# EAGLE schematic MiniLab (EAGLE 7.5.0)
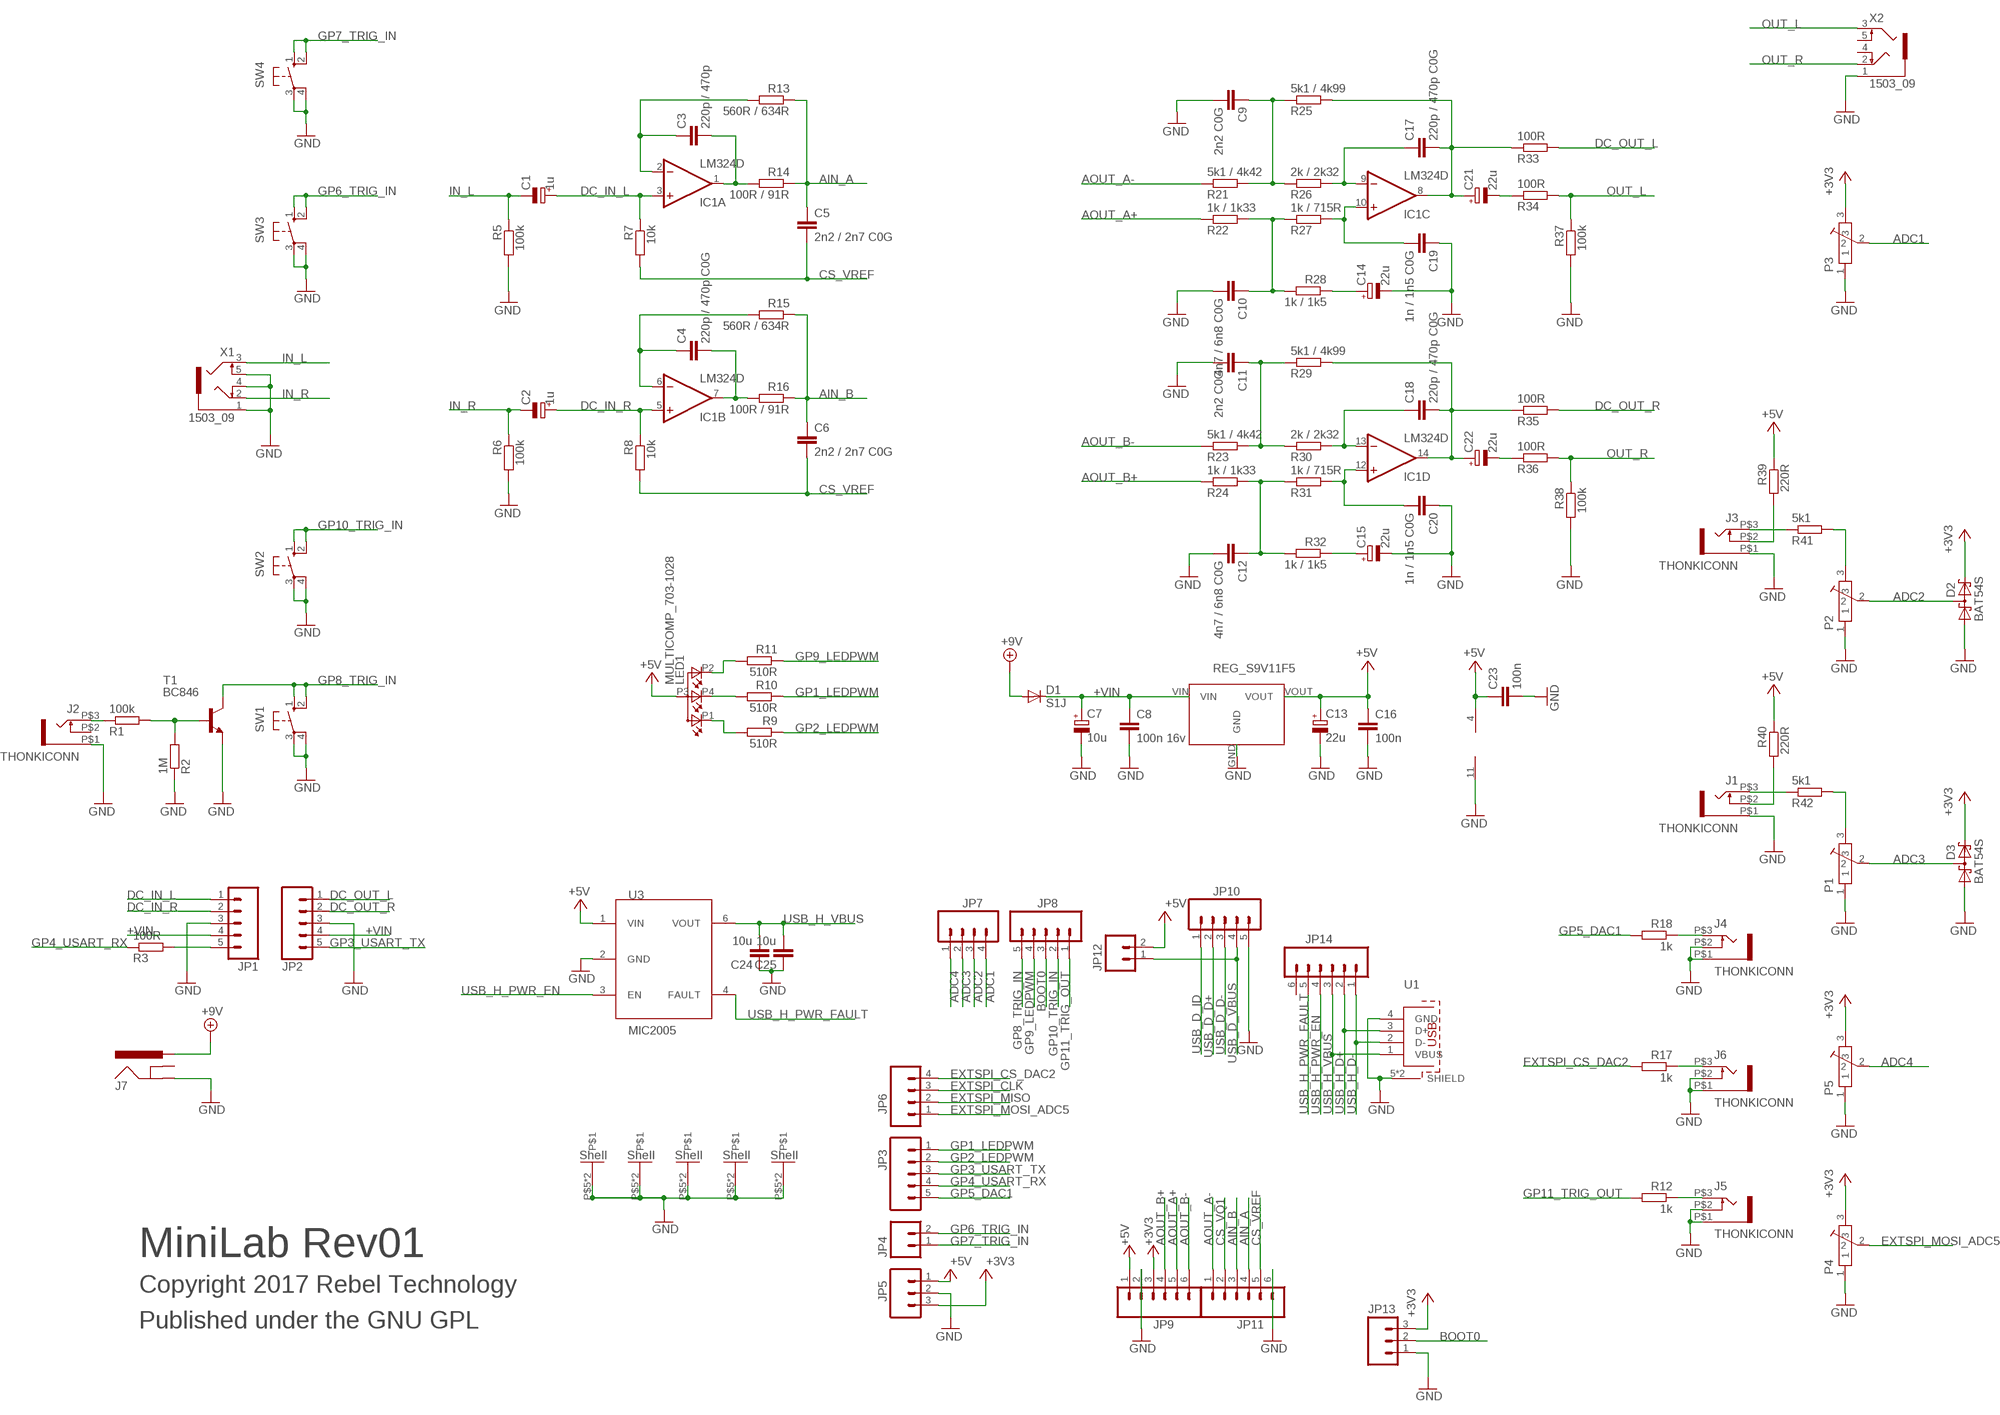
[diagram p0: schematic, sheet 1]

## Parts
C1  1u  CPOL-EU153CLV-0405  [153CLV-0405]
C2  1u  CPOL-EU153CLV-0405  [153CLV-0405]
C3  220p / 470p  C-EUC0603  [C0603]
C4  220p / 470p C0G  C-EUC0603  [C0603]
C5  2n2 / 2n7 C0G  C-EUC0603  [C0603]
C6  2n2 / 2n7 C0G  C-EUC0603  [C0603]
C7  10u  CPOL-EU153CLV-0405  [153CLV-0405]
C8  100n 16v  C-EUC0603  [C0603]
C9  2n2 C0G  C-EUC0603  [C0603]
C10  4n7 / 6n8 C0G  C-EUC0603  [C0603]
C11  2n2 C0G  C-EUC0603  [C0603]
C12  4n7 / 6n8 C0G  C-EUC0603  [C0603]
C13  22u  CPOL-EU153CLV-0505  [CPOL-5]
C14  22u  CPOL-EU153CLV-0505  [CPOL-5]
C15  22u  CPOL-EU153CLV-0505  [CPOL-5]
C16  100n  C-EUC0603  [C0603]
C17  220p / 470p C0G  C-EUC0603  [C0603]
C18  220p / 470p C0G  C-EUC0603  [C0603]
C19  1n / 1n5 C0G  C-EUC0603  [C0603]
C20  1n / 1n5 C0G  C-EUC0603  [C0603]
C21  22u  CPOL-EU153CLV-0505  [CPOL-5]
C22  22u  CPOL-EU153CLV-0505  [CPOL-5]
C23  100n  C-EUC0603  [C0603]
C24  10u  C-EUC0603  [C0603]
C25  10u  C-EUC0603  [C0603]
D1  S1J  DIODESMA  [SMA-DIODE]
D2  BAT54S  [SOT23]
D3  BAT54S  [SOT23]
IC1  LM324D  [SO14]
J1  THONKICONN  [THONKICONN]
J2  THONKICONN  [THONKICONN]
J3  THONKICONN  [THONKICONN]
J4  THONKICONN  [THONKICONN]
J5  THONKICONN  [THONKICONN]
J6  THONKICONN  [THONKICONN]
J7  POWER_JACKPTH  [POWER_JACK_PTH]
JP1  M05PTH  [1X05]
JP2  M05PTH  [1X05]
JP3  M05PTH  [1X05]
JP4  M02PTH  [1X02]
JP5  M03PTH  [1X03]
JP6  M04PTH  [1X04]
JP7  M04PTH  [1X04]
JP8  M05PTH  [1X05]
JP9  M06SIP  [1X06]
JP10  M05PTH  [1X05]
JP11  M06SIP  [1X06]
JP12  M02PTH  [1X02]
JP13  M03PTH  [1X03]
JP14  M06SIP  [1X06]
LED1  MULTICOMP_703-1028  [RGB-LED-703-1028]
P1  POT-ALPS-RK09L1140  [POT-ALPS-RK09L1140]
P2  POT-ALPS-RK09L1140  [POT-ALPS-RK09L1140]
P3  POT-ALPS-RK09L1140  [POT-ALPS-RK09L1140]
P4  POT-ALPS-RK09L1140  [POT-ALPS-RK09L1140]
P5  POT-ALPS-RK09L1140  [POT-ALPS-RK09L1140]
R1  100k  R-EU_0603  [0603]
R2  1M  R-EU_0603  [0603]
R3  100R  R-EU_0603  [0603]
R5  100k  R-EU_0603  [0603]
R6  100k  R-EU_0603  [0603]
R7  10k  R-EU_0603  [0603]
R8  10k  R-EU_0603  [0603]
R9  510R  R-EU_0603  [0603]
R10  510R  R-EU_0603  [0603]
R11  510R  R-EU_0603  [0603]
R12  1k  R-EU_0603  [0603]
R13  560R / 634R  R-EU_0603  [0603]
R14  100R / 91R  R-EU_0603  [0603]
R15  560R / 634R  R-EU_0603  [0603]
R16  100R / 91R  R-EU_0603  [0603]
R17  1k  R-EU_0603  [0603]
R18  1k  R-EU_0603  [0603]
R21  5k1 / 4k42  R-EU_0603  [0603]
R22  1k / 1k33  R-EU_0603  [0603]
R23  5k1 / 4k42  R-EU_0603  [0603]
R24  1k / 1k33  R-EU_0603  [0603]
R25  5k1 / 4k99  R-EU_0603  [0603]
R26  2k / 2k32  R-EU_0603  [0603]
R27  1k / 715R  R-EU_0603  [0603]
R28  1k / 1k5  R-EU_0603  [0603]
R29  5k1 / 4k99  R-EU_0603  [0603]
R30  2k / 2k32  R-EU_0603  [0603]
R31  1k / 715R  R-EU_0603  [0603]
R32  1k / 1k5  R-EU_0603  [0603]
R33  100R  R-EU_0603  [0603]
R34  100R  R-EU_0603  [0603]
R35  100R  R-EU_0603  [0603]
R36  100R  R-EU_0603  [0603]
R37  100k  R-EU_0603  [0603]
R38  100k  R-EU_0603  [0603]
R39  220R  R-EU_0603  [0603]
R40  220R  R-EU_0603  [0603]
R41  5k1  R-EU_0603  [0603]
R42  5k1  R-EU_0603  [0603]
SW1  10-XX  [B3F-10XX]
SW2  10-XX  [B3F-10XX]
SW3  10-XX  [B3F-10XX]
SW4  10-XX  [B3F-10XX]
T1  BC846  [SOT23]
U1  614104190121  [614104190121]
U2  REG_S9V11F5  [REG_S9V11F5]
U3  MIC2005  [SOT23-6]
X1  1503_09  [1503_09]
X2  1503_09  [1503_09]

## Nets
+3V3: D2.2(C2) D3.2(C2) JP5.3 JP9.3 JP13.3 P3.3 P4.3 P5.3
+5V: C13.+ C16.1 C23.1 IC1.4(P:V+) JP5.1 JP9.1 JP12.2 LED1.P3(A) R39.1 R40.1 U2.VOUT U3.1(VIN)
+9V: D1.A J7.PWR
+VIN: C7.+ C8.1 D1.C JP1.4 JP2.4 U2.VIN
ADC1: JP7.4 P3.2
ADC2: D2.3(C1A2) JP7.3 P2.2
ADC3: D3.3(C1A2) JP7.2 P1.2
ADC4: JP7.1 P5.2
AIN_A: C5.1 JP11.4 R13.1 R14.1
AIN_B: C6.1 JP11.3 R15.1 R16.1
AOUT_A+: JP9.5 R22.1
AOUT_A-: JP11.1 R21.1
AOUT_B+: JP9.4 R24.1
AOUT_B-: JP9.6 R23.1
BOOT0: JP8.3 JP13.2
CS_VQ1: JP11.2
CS_VREF: C5.2 C6.2 JP11.5 R7.2 R8.2
DC_IN_L: C1.+ IC1.3(A:+IN) JP1.1 R7.1
DC_IN_R: C2.+ IC1.5(B:+IN) JP1.2 R8.1
DC_OUT_L: JP2.1 R33.2
DC_OUT_R: JP2.2 R35.2
EXTSPI_CLK: JP6.3
EXTSPI_CS_DAC2: JP6.4 R17.2
EXTSPI_MISO: JP6.2
EXTSPI_MOSI_ADC5: JP6.1 P4.2
GND: C7.- C8.2 C9.2 C10.2 C11.2 C12.2 C13.- C14.- C15.- C16.2 C19.1 C20.1 C23.2 C24.1 C25.1 D2.1(A1) D3.1(A1) IC1.11(P:V-) J1.P$1 J2.P$1 J3.P$1 J4.P$1 J4.P$2 J5.P$1 J5.P$2 J6.P$1 J6.P$2 J7.GND JP1.3 JP2.3 JP5.2 JP9.2 JP10.5 JP11.6 JP13.1 P1.1 P1.P$5 P1.P$6 P2.1 P2.P$5 P2.P$6 P3.1 P3.P$5 P3.P$6 P4.1 P4.P$5 P4.P$6 P5.1 P5.P$5 P5.P$6 R2.1 R5.2 R6.2 R37.2 R38.2 SW1.3(P) SW1.4(P1) SW2.3(P) SW2.4(P1) SW3.3(P) SW3.4(P1) SW4.3(P) SW4.4(P1) T1.2(E) U1.4(GND) U1.5(SHIELD) U1.6(SHIELD) U2.GND U3.2(GND) X1.1 X1.4 X1.5 X2.1
GP1_LEDPWM: JP3.1 R10.1
GP2_LEDPWM: JP3.2 R9.1
GP3_USART_TX: JP2.5 JP3.3
GP4_USART_RX: JP3.4 R3.1
GP5_DAC1: JP3.5 R18.2
GP6_TRIG_IN: JP4.2 SW3.1(S) SW3.2(S1)
GP7_TRIG_IN: JP4.1 SW4.1(S) SW4.2(S1)
GP8_TRIG_IN: JP8.5 SW1.1(S) SW1.2(S1) T1.3(C)
GP9_LEDPWM: JP8.4 R11.1
GP10_TRIG_IN: JP8.2 SW2.1(S) SW2.2(S1)
GP11_TRIG_OUT: JP8.1 R12.2
IN_L: C1.- R5.1 X1.3
IN_R: C2.- R6.1 X1.2
N$1: JP1.5 R3.2
N$2: J1.P$2 R40.2
N$3: C3.1 IC1.2(A:-IN) R13.2
N$4: C4.2 IC1.7(B:OUT) R16.2
N$5: C4.1 IC1.6(B:-IN) R15.2
N$6: C3.2 IC1.1(A:OUT) R14.2
N$7: C17.1 IC1.9(C:-IN) R26.2
N$8: C15.+ R32.1
N$9: C21.- R34.1
N$10: C14.+ R28.1
N$11: C19.2 IC1.10(C:+IN) R27.2
N$12: C18.2 C22.+ IC1.14(D:OUT) R29.2 R35.1
N$13: C22.- R36.1
N$14: LED1.P2(CGREEN) R11.2
N$15: C10.1 R22.2 R27.1 R28.2
N$16: LED1.P1(CRED) R9.2
N$17: LED1.P4(CBLUE) R10.2
N$19: J5.P$3 R12.1
N$20: J6.P$3 R17.1
N$21: J4.P$3 R18.1
N$22: J2.P$3 R1.1
N$23: J3.P$2 R39.2
N$24: C11.1 R23.2 R29.1 R30.1
N$25: P2.3 R41.2
N$26: C18.1 IC1.13(D:-IN) R30.2
N$27: J3.P$3 R41.1
N$30: C20.2 IC1.12(D:+IN) R31.2
N$31: P1.3 R42.2
N$32: C12.1 R24.2 R31.1 R32.2
N$33: J1.P$3 R42.1
N$37: R1.2 R2.2 T1.1(B)
N$39: C17.2 C21.+ IC1.8(C:OUT) R25.2 R33.1
N$41: C9.1 R21.2 R25.1 R26.1
OUT_L: R34.2 R37.1 X2.3
OUT_R: R36.2 R38.1 X2.2
USB_D_D+: JP10.2
USB_D_D-: JP10.3
USB_D_ID: JP10.1
USB_D_VBUS: JP10.4 JP12.1
USB_H_D+: JP14.2 U1.3(D+)
USB_H_D-: JP14.1 U1.2(D-)
USB_H_PWR_EN: JP14.4 U3.3(EN)
USB_H_PWR_FAULT: JP14.5 U3.4(FAULT)
USB_H_VBUS: C24.2 C25.2 JP14.3 U1.1(VBUS) U3.6(VOUT)
Unconnected: J2.P$2 J7.GNDBREAK JP14.6 X2.4 X2.5

## Notes on the sheet
- MiniLab Rev01
- Copyright 2017 Rebel Technology
- Published under the GNU GPL

## Library data of the parts
C1 C2 C7 C13-C15 C21 C22 = Rebel:CPOL-EU: POLARIZED CAPACITOR, European symbol
C3-C6 C9-C12 C17-C20 C23-C25 = resistor:C-EU: CAPACITOR, European symbol
C8 C16 = Rebel:C-EU: CAPACITOR, European symbol
D1 = SparkFun:DIODE: Diode These are standard reverse protection diodes and small signal diodes. SMA package can handle up to about 1A. SOD-323 can handle about 200mA. What the SOD-323 package when ordering, there are some mfgs out there that are 5-pin packages.
D2 D3 = diode:BAT54S: Schottky Diodes Pin connection corrected 2011-05-04 Source: Fairchild .. BAT54.pdf
IC1 = linear:LM324: OP AMP
J1-J6 = Rebel:THONKICONN
J7 = SparkFun:POWER_JACK: Power Jack This is the standard 5.5mm barrel jack for power. The PTH is the most common, proven, reliable, footprint. All others are experimental. The Slot footprint only works if the mill layer is transmitted to the PCB fab house so be warned. Spark Fun Electronics SKU : PRT-00119. Mating wall wart : TOL-00298 (and others)
JP1-JP3 JP8 JP10 = SparkFun:M05: Header 5 Standard 5-pin 0.1" header. Use with straight break away headers (SKU : PRT-00116), right angle break away headers (PRT-00553), swiss pins (PRT-00743), machine pins (PRT-00117), and female headers (PRT-00115). Molex polarized connector foot print use with SKU : PRT-08230 with associated crimp pins and housings.
JP4 JP12 = SparkFun:M02: Header 2 Standard 2-pin 0.1" header. Use with straight break away headers (SKU : PRT-00116), right angle break away headers (PRT-00553), swiss pins (PRT-00743), machine pins (PRT-00117), and female headers (PRT-00115). Molex polarized connector foot print use with SKU : PRT-08233 with associated crimp pins and housings.
JP5 JP13 = SparkFun:M03: Header 3 Standard 3-pin 0.1" header. Use with straight break away headers (SKU : PRT-00116), right angle break away headers (PRT-00553), swiss pins (PRT-00743), machine pins (PRT-00117), and female headers (PRT-00115). Molex polarized connector foot print use with SKU : PRT-08232 with associated crimp pins and housings.
JP6 JP7 = SparkFun:M04: Header 4 Standard 4-pin 0.1" header. Use with straight break away headers (SKU : PRT-00116), right angle break away headers (PRT-00553), swiss pins (PRT-00743), machine pins (PRT-00117), and female headers (PRT-00115). Molex polarized connector foot print use with SKU : PRT-08231 with associated crimp pins and housings. 1MM SMD Version SKU: PRT-10208
JP9 JP11 JP14 = SparkFun:M06: Header 6 Standard 6-pin 0.1" header. Use with straight break away headers (SKU : PRT-00116), right angle break away headers (PRT-00553), swiss pins (PRT-00743), machine pins (PRT-00117), and female headers (PRT-00115). Molex polarized connector foot print use with SKU : PRT-08094 with associated crimp pins and housings. NOTES ON THE VARIANTS LOCK and LOCK_LONGPADS... This footprint was designed to help hold the alignment of a through-hole component (i.e. 6-pin header) while soldering it into place. You may notice that each hole has been shifted either up or down by 0.005 of an inch from it's more standard position (which is a perfectly straight line). This slight alteration caused the pins (the squares in the middle) to touch the edges of the holes. Because they are alternating, it causes a "brace" to hold the component in place. 0.005 has proven to be the perfect amount of "off-center" position when using our standard breakaway headers. Although looks a little odd when you look at the bare footprint, once you have a header in there, the alteration is very hard to notice. Also, if you push a header all the way into place, it is covered up entirely on the bottom side. This idea of altering the position of holes to aid alignment will be further integrated into the Sparkfun Library for other footprints. It can help hold any component with 3 or more connection pins.
LED1 = Rebel:MULTICOMP_703-1028: Farnell: 2112143
P1-P5 = Rebel:POT-ALPS-RK09L
R1-R3 R5-R18 R21-R42 = Rebel:R-EU_: RESISTOR, European symbol
SW1-SW4 = switch-omron:10-XX: OMRON SWITCH; MPN: B3F-1000; OC_FARNELL: 176432; OC_NEWARK: 36M3542
T1 = transistor:BC846: NPN TRANSISTOR
U1 = Wurth-connectors:614104190121: USB TYPE A HORIZONTAL THT -SHORT TYPE =>ConUSB2 614104190121 Characteristics INSULATOR: LCP FLAMMABILITY RATING: UL94-V0 COLOR: BLACK CONTACT MATERIAL: COPPER ALLOY CONTACT PLATING: GOLD OVER Ni COVER MATERIAL: STAINLESS STEEL COVER PLATING: Ni QUALITY CLASS: 5 000 MATING CYCLES OPERATING TEMPERATURE:-55°C UP TO +85°C COMPLIANCE: LEAD FREE AND ROHS ELECTRICAL CURRENT RATING: 1.5A WORKING VOLTAGE: 30 VAC MAX WITHSTANDING VOLTAGE: 500 VAC/MIN INSULATION RESISTANCE: > 1000 MΩ CONTACT RESISTANCE: 30 mΩ MAX <http://katalog.we-online.de/media/images/v2/Family_WR-COM_614104190121_4C.jpg> Details see: http://katalog.we-online.de/en/em/COM_THT_TYPE_A_HORIZONTAL/614104190121 2015 (C) Wurth Elektronik
U2 = Rebel:REG_S9V11F5
U3 = James:MIC2005; OC_FARNELL: 2509882
X1 X2 = con-lumberg:1503_09: Jack connectors according to JISC 6560, 3.5 mm Klinkeneinbaukupplung nach JISC 6560, 3,5 mm, 3-polig/ stereo, abgewinkelte Ausführung, mit 2 Öffnern und Lötaugen, für Leiterplatten Rückseitenmontage Source: http://www.lumberg.com/Produkte/PDFs/1503_09.pdf; OC_FARNELL: 1243244; OC_NEWARK: unknown

## Net classes
1 power: width 0.178 mm, drill 0.305 mm, clearance 0.178 mm to class 0, clearance 0.178 mm